# Altium schematic sheet GreenBeing_blockdiagram.SchDoc: Green Being
size A4; Date: 16/05/2022; Author: Bugliazzini Tommaso; CompanyName: GreenBeing; DrawnBy: Tommaso Bugliazzini; Engineer: Tommaso Bugliazzini; Organization: GreenBeing; Revision: 1; SheetNumber: 2; SheetTotal: 1; Note: Block Diagram
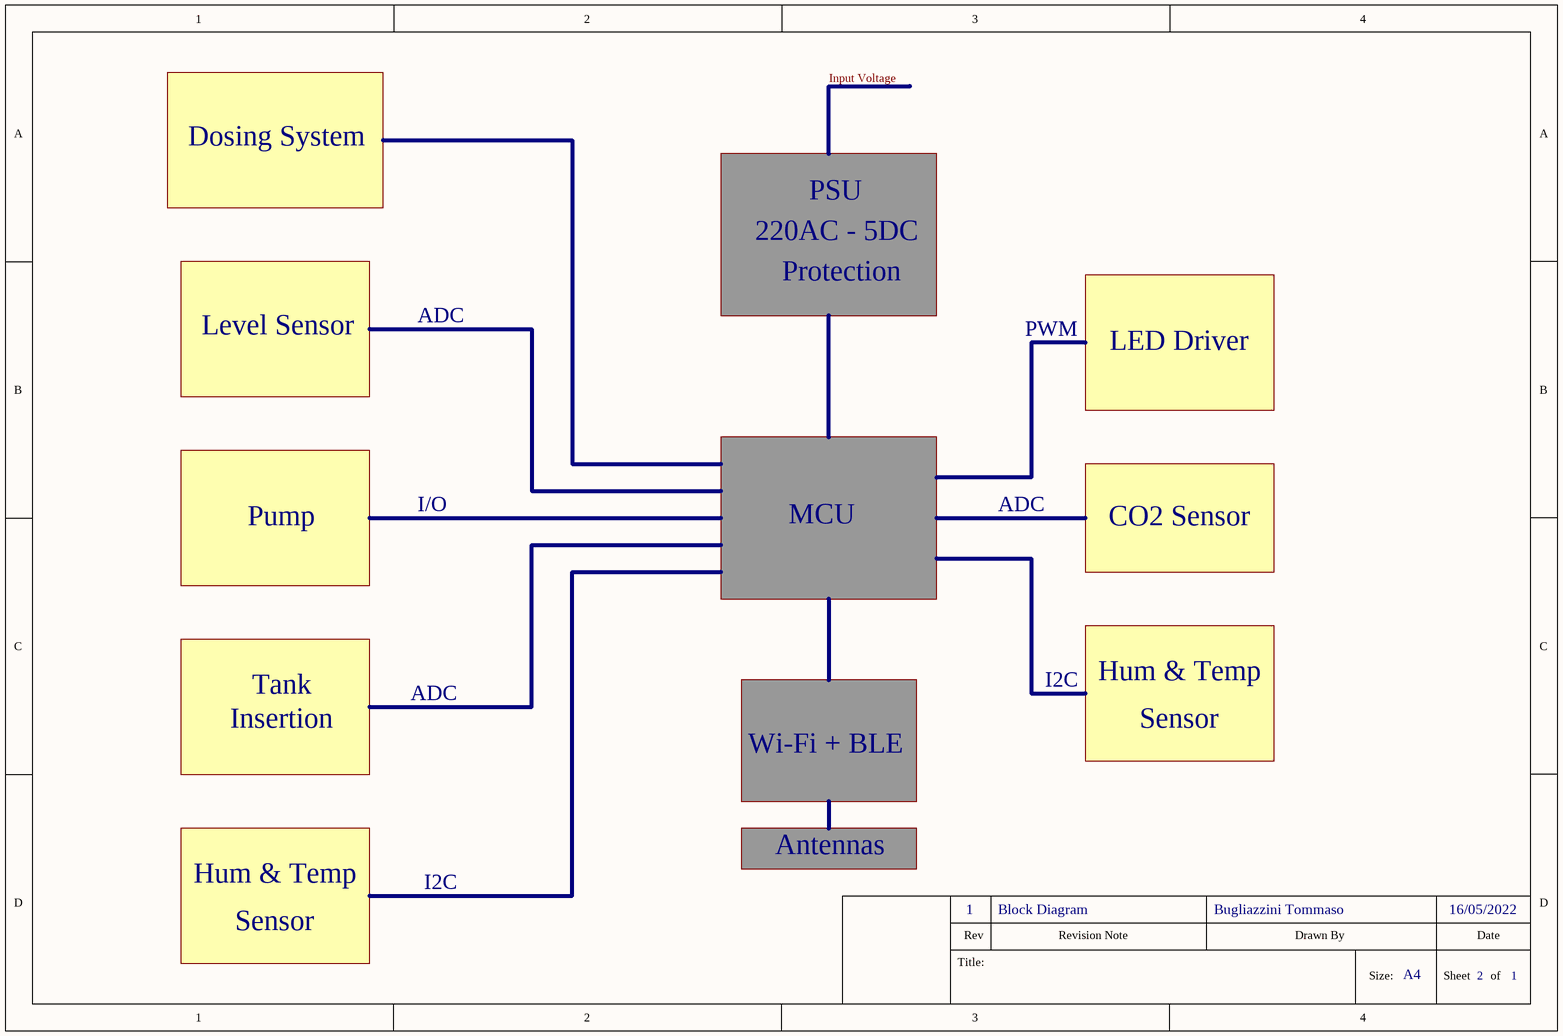
[diagram p0: GreenBeing_blockdiagram.SchDoc]

## Notes on the sheet
- Dosing System
- 220AC - 5DC
- PSU
- Protection
- Level Sensor
- ADC
- PWM
- LED Driver
- Pump
- I/O
- CO2 Sensor
- MCU
- Hum & Temp
- Insertion
- Tank
- I2C
- Sensor
- Wi-Fi + BLE
- Antennas
- Title:
- Rev
- Revision Note
- Drawn By
- Size:
- A4
- Sheet
- Date
- of